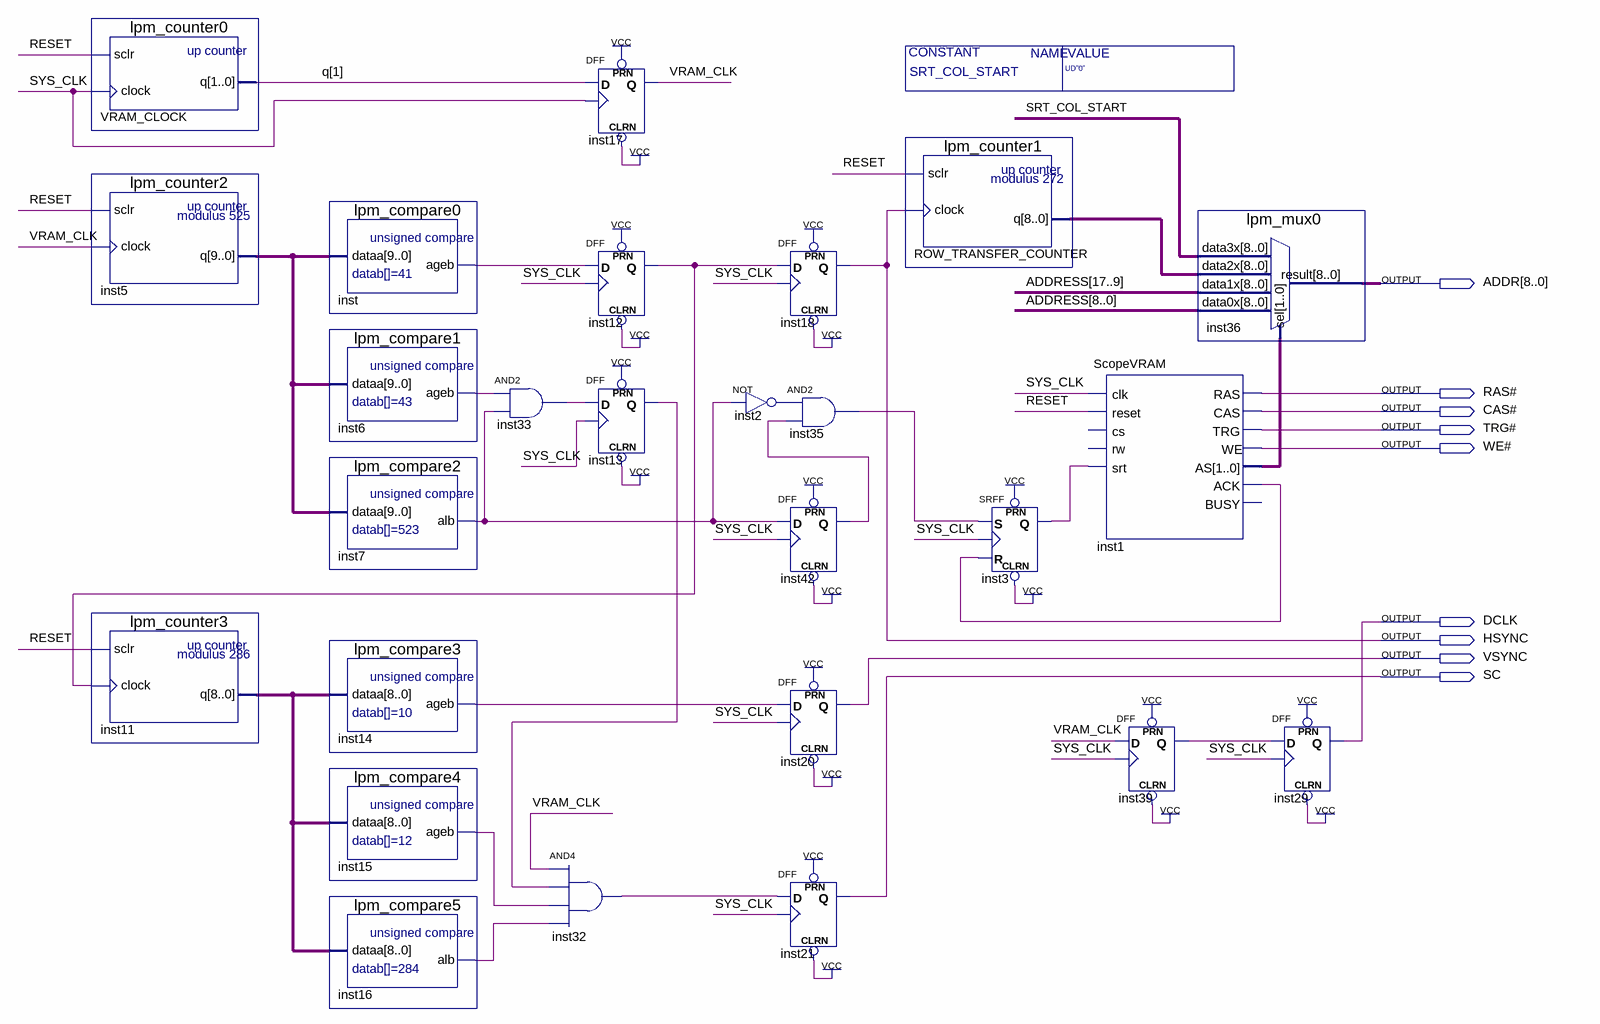
[diagram p0: schematic sheet]
// Quartus schematic FPGA-Oscilloscope.bdf as structural Verilog: 26 symbols, 9 pins
module \FPGA-Oscilloscope  #(parameter SRT_COL_START = "UD\"0\"") (
  output [8:0] ADDR,
  output \RAS# ,
  output \CAS# ,
  output \TRG# ,
  output \WE# ,
  output DCLK,
  output HSYNC,
  output VSYNC,
  output SC
);

  wire inst1_ack, inst2_out, inst3_q, inst6_ageb, inst7_alb, inst12_q, inst13_q, inst14_ageb, inst15_ageb,
       inst16_alb, inst32_out, inst33_out, inst35_out, inst39_q, inst42_q, inst_ageb, RESET, SRT_COL_START,
       SYS_CLK, VRAM_CLK;
  wire [1:0] inst1_as;
  wire [1:1] q;
  wire [8:0] inst11_q, ROW_TRANSFER_COUNTER_q;
  wire [9:0] inst5_q;
  wire [17:0] ADDRESS;

  lpm_counter0 VRAM_CLOCK (.sclr(RESET), .clock(SYS_CLK), .q(q[1]));
  lpm_counter2 inst5 (.sclr(RESET), .clock(VRAM_CLK), .q(inst5_q));
  lpm_counter3 inst11 (.sclr(RESET), .clock(inst12_q), .q(inst11_q));
  lpm_compare0 inst (.dataa(inst5_q), .ageb(inst_ageb));
  lpm_compare1 inst6 (.dataa(inst5_q), .ageb(inst6_ageb));
  lpm_compare2 inst7 (.dataa(inst5_q), .alb(inst7_alb));
  lpm_compare3 inst14 (.dataa(inst11_q), .ageb(inst14_ageb));
  lpm_compare4 inst15 (.dataa(inst11_q), .ageb(inst15_ageb));
  lpm_compare5 inst16 (.dataa(inst11_q), .alb(inst16_alb));
  and inst33 (inst33_out, inst6_ageb, inst7_alb);
  and inst32 (inst32_out, VRAM_CLK, inst13_q, inst15_ageb, inst16_alb);
  DFF inst17 (.CLRN(1'b1), .CLK(SYS_CLK), .D(q[1]), .PRN(1'b1), .Q(VRAM_CLK));
  DFF inst12 (.CLRN(1'b1), .CLK(SYS_CLK), .D(inst_ageb), .PRN(1'b1), .Q(inst12_q));
  DFF inst13 (.CLRN(1'b1), .CLK(SYS_CLK), .D(inst33_out), .PRN(1'b1), .Q(inst13_q));
  not inst2 (inst2_out, inst7_alb);
  DFF inst18 (.CLRN(1'b1), .CLK(SYS_CLK), .D(inst12_q), .PRN(1'b1), .Q(HSYNC));
  and inst35 (inst35_out, inst2_out, inst42_q);
  DFF inst42 (.CLRN(1'b1), .CLK(SYS_CLK), .D(inst7_alb), .PRN(1'b1), .Q(inst42_q));
  DFF inst20 (.CLRN(1'b1), .CLK(SYS_CLK), .D(inst14_ageb), .PRN(1'b1), .Q(VSYNC));
  DFF inst21 (.CLRN(1'b1), .CLK(SYS_CLK), .D(inst32_out), .PRN(1'b1), .Q(SC));
  lpm_counter1 ROW_TRANSFER_COUNTER (.sclr(RESET), .clock(HSYNC), .q(ROW_TRANSFER_COUNTER_q));
  SRFF inst3 (.PRN(1'b1), .CLRN(1'b1), .S(inst35_out), .R(inst1_ack), .CLK(SYS_CLK), .Q(inst3_q));
  ScopeVRAM inst1 (
    .clk(SYS_CLK), .reset(RESET), .srt(inst3_q), .RAS(\RAS# ), .CAS(\CAS# ), .TRG(\TRG# ), .WE(\WE# ),
    .AS(inst1_as), .ACK(inst1_ack));  // open: cs, rw, BUSY
  DFF inst39 (.CLRN(1'b1), .CLK(SYS_CLK), .D(VRAM_CLK), .PRN(1'b1), .Q(inst39_q));
  lpm_mux0 inst36 (
    .data3x({9{SRT_COL_START}}), .data2x(ROW_TRANSFER_COUNTER_q), .data1x(ADDRESS[17:9]),
    .data0x(ADDRESS[8:0]), .sel(inst1_as), .result(ADDR));
  DFF inst29 (.CLRN(1'b1), .CLK(SYS_CLK), .D(inst39_q), .PRN(1'b1), .Q(DCLK));
endmodule
